# EAGLE design Sensorboard (EAGLE 9.6.2)
Assembly variants: Ohne Dioden
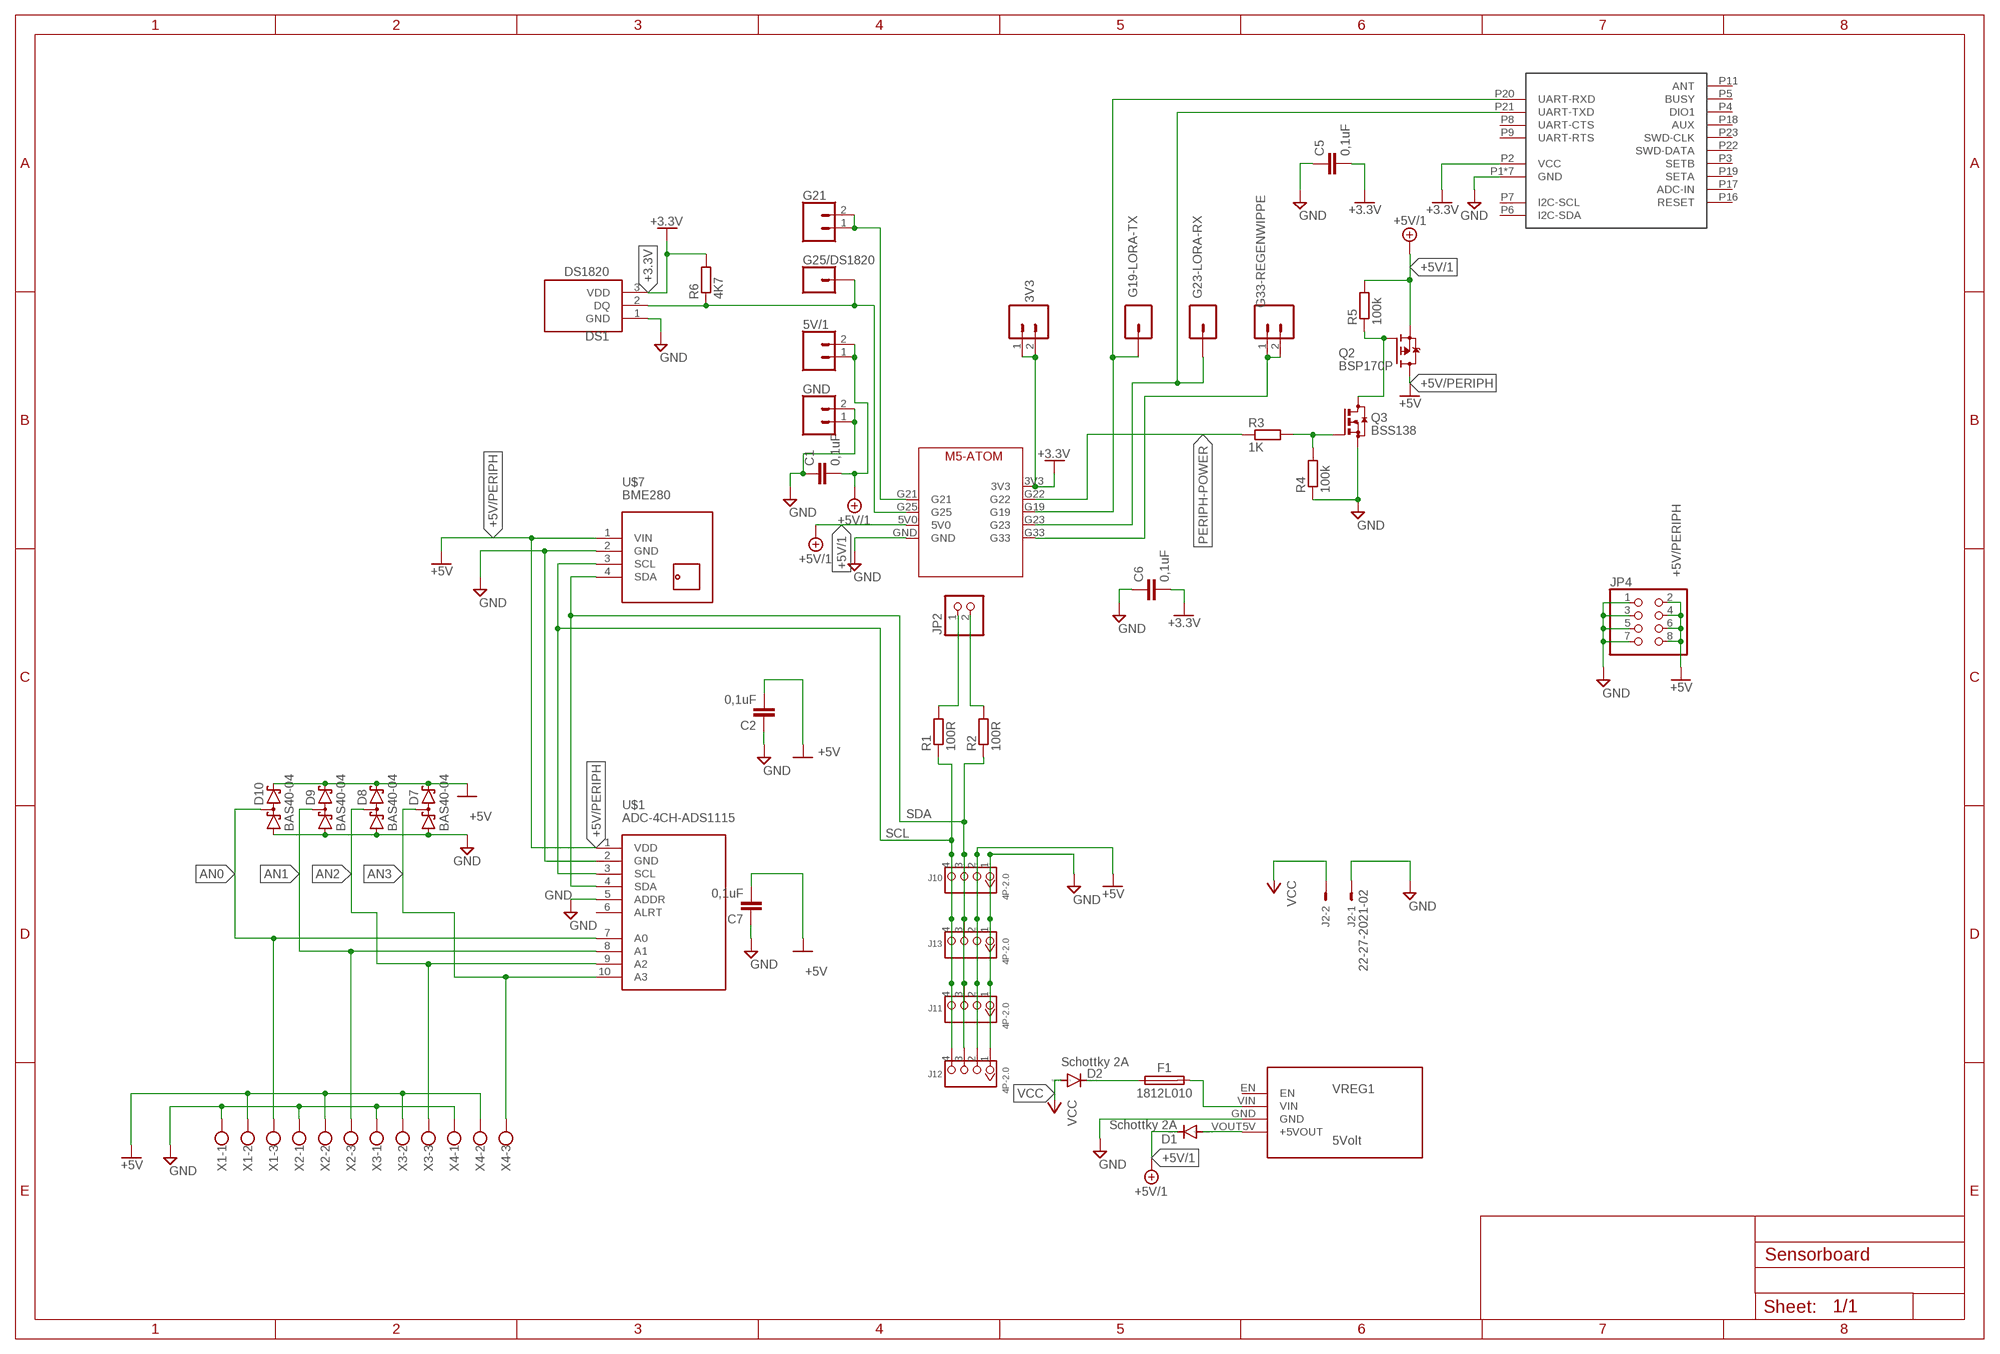
[diagram p0: schematic, sheet 1]

## Parts
3V3  CONN_02  [1X02]
5V/1  CONN_02  [1X02]
C1  0,1uF  C-EU025-025X050  [C025-025X050]
C2  0,1uF  C-EU025-025X050  [C025-025X050]
C5  0,1uF  C-EU025-025X050  [C025-025X050]
C6  0,1uF  C-EU025-025X050  [C025-025X050]
C7  0,1uF  C-EU025-025X050  [C025-025X050]
D1  Schottky 2A  1N4004  [DO41-10]
D2  Schottky 2A  1N4004  [DO41-10]
D7  BAS40-04  [SOT23]  (not fitted in variant Ohne Dioden)
D8  BAS40-04  [SOT23]  (not fitted in variant Ohne Dioden)
D9  BAS40-04  [SOT23]  (not fitted in variant Ohne Dioden)
D10  BAS40-04  [SOT23]  (not fitted in variant Ohne Dioden)
DS1  DS1820  [DS1820-TO92]
F1  1812L010  [FUSC4532X125]
G19-LORA-TX  CONN_01  [1X01]
G21  CONN_02  [1X02]
G23-LORA-RX  CONN_01  [1X01]
G25/DS1820  CONN_01  [1X01]
G33-REGENWIPPE  CONN_02  [1X02]
GND  CONN_02  [1X02]
J2  22-27-2021-02  [6410-02]
J10  4P-2.0  GROVE-CONNECTOR-DIP(4P-2.0)  [HW4-2.0]
J11  4P-2.0  GROVE-CONNECTOR-DIP(4P-2.0)  [HW4-2.0]
J12  4P-2.0  GROVE-CONNECTOR-DIP(4P-2.0)  [HW4-2.0]
J13  4P-2.0  GROVE-CONNECTOR-DIP(4P-2.0)  [HW4-2.0]
JP2  PINHD-1X2  [1X02]
JP4  PINHD-2X4  [2X04]
M5-ATOM  M5-ATOM  [M5-ATOM]
Q2  BSP170P  [SOT223]
Q3  BSS138  BSS123  [SOT23]
R1  100R  R-EU_0204/7  [0204/7]
R2  100R  R-EU_0204/7  [0204/7]
R3  1K  R-EU_R1206  [R1206]
R4  100k  R-EU_R1206  [R1206]
R5  100k  R-EU_R1206  [R1206]
R6  4K7  R-EU_R1206  [R1206]
U$1  ADC-4CH-ADS1115  [ADC-4CH-ADS1115]
U$2  E78-868LN22S  [E78-868LN22S]
U$7  BME280  TEMP-HUM-PRES-BME280  [TEMP-HUM-PRES-BME280]
VREG1  5Volt  VREG-STEPDOWN  [VREG-STEPDOWN]
X1  W237-103-RB  [W237-103-RB]
X2  W237-103-RB  [W237-103-RB]
X3  W237-103-RB  [W237-103-RB]
X4  W237-103-RB  [W237-103-RB]

## Nets
+3.3V [3V]: 3V3.1 3V3.2 C5.2 C6.2 DS1.3(VDD) M5-ATOM.3V3 R6.2 U$2.P2(VCC)
+5V/1: 5V/1.1 5V/1.2 C1.2 D1.C M5-ATOM.5V0 Q2.3(S) R5.2
+5V/PERIPH [5V]: C2.2 C7.2 D7.2(C2) D8.2(C2) D9.2(C2) D10.2(C2) J10.2 J11.2 J12.2 J13.2 JP4.2 JP4.4 JP4.6 JP4.8 Q2.2(D) Q2.4(D) U$1.1(VDD) U$7.1(VIN) X1.2 X2.2 X3.2 X4.2 ; supply symbol labelled +5V
AN0 [Analog]: D10.3(C1A2) U$1.7(A0) X1.3
AN1 [Analog]: D9.3(C1A2) U$1.8(A1) X2.3
AN2 [Analog]: D8.3(C1A2) U$1.9(A2) X3.3
AN3 [Analog]: D7.3(C1A2) U$1.10(A3) X4.3
GND: C1.1 C2.1 C5.1 C6.1 C7.1 D7.1(A1) D8.1(A1) D9.1(A1) D10.1(A1) DS1.1(GND) GND.1 GND.2 J2.1 J10.1 J11.1 J12.1 J13.1 JP4.1 JP4.3 JP4.5 JP4.7 M5-ATOM.GND Q3.2(S) R4.1 U$1.2(GND) U$1.5(ADDR) U$2.P1(GND) U$2.P10(GND) U$2.P12(GND) U$2.P13(GND) U$2.P14(GND) U$2.P15(GND) U$2.P24(GND) U$7.2(GND) VREG1.GND X1.1 X2.1 X3.1 X4.1
LORA-RX [Signal]: G23-LORA-RX.1 M5-ATOM.G23 U$2.P21(UART-TXD)
LORA-TX [Signal]: G19-LORA-TX.1 M5-ATOM.G19 U$2.P20(UART-RXD)
N$4 [Signal]: G33-REGENWIPPE.1 G33-REGENWIPPE.2 M5-ATOM.G33
N$5: JP2.1 R1.2
N$6 [Signal]: DS1.2(DQ) G25/DS1820.1 M5-ATOM.G25 R6.1
N$7 [Signal]: G21.1 G21.2 M5-ATOM.G21
N$8: JP2.2 R2.2
N$9: D1.A VREG1.VOUT5V(+5VOUT)
N$11: Q3.1(G) R3.2 R4.2
N$12: D2.C F1.1
N$13: F1.2 VREG1.VIN
N$16: Q2.1(G) Q3.3(D) R5.1
PERIPH-POWER [Signal]: M5-ATOM.G22 R3.1
SCL [Signal]: J10.4 J11.4 J12.4 J13.4 R1.1 U$1.3(SCL) U$7.3(SCL)
SDA [Signal]: J10.3 J11.3 J12.3 J13.3 R2.1 U$1.4(SDA) U$7.4(SDA)
VCC: D2.A J2.2
Unconnected: U$1.6(ALRT) U$2.P3(SETB) U$2.P4(DIO1) U$2.P5(BUSY) U$2.P6(I2C-SDA) U$2.P7(I2C-SCL) U$2.P8(UART-CTS) U$2.P9(UART-RTS) U$2.P11(ANT) U$2.P16(RESET) U$2.P17(ADC-IN) U$2.P18(AUX) U$2.P19(SETA) U$2.P22(SWD-DATA) U$2.P23(SWD-CLK) VREG1.EN

## Library data of the parts
3V3 5V/1 G21 G33-REGENWIPPE GND = SparkFun-Connectors:CONN_02: Multi connection point. Often used as Generic Header-pin footprint for 0.1 inch spaced/style header connections On any of the 0.1 inch spaced packages, you can populate with these: Break Away Headers - Straight <https://www.sparkfun.com/products/116> (PRT-00116) Break Away Male Headers - Right Angle <https://www.sparkfun.com/products/553> (PRT-00553) Female Headers <https://www.sparkfun.com/products/115> (PRT-00115) Break Away Headers - Machine Pin <https://www.sparkfun.com/products/117> (PRT-00117) Break Away Female Headers - Swiss Machine Pin <https://www.sparkfun.com/products/743> (PRT-00743) For SCREWTERMINALS and SPRING TERMINALS visit here: Screw Terimnals on SparkFun.com <https://www.sparkfun.com/search/results?term=Screw+Terminals> (5mm/3.5mm/2.54mm spacing) This device is also useful as a general connection point to wire up your design to another part of your project. Our various solder wires solder well into these plated through hole pads. Hook-Up Wire - Assortment (Stranded, 22 AWG) <https://www.sparkfun.com/products/11375> (PRT-11375) Hook-Up Wire - Assortment (Solid Core, 22 AWG) <https://www.sparkfun.com/products/11367> (PRT-11367) View the entire wire category on our website here <https://www.sparkfun.com/categories/141> Special notes: Molex polarized connector foot print use with: PRT-08233 with associated crimp pins and housings. 2.54_SCREWTERM for use with PRT-10571. 3.5mm Screw Terminal footprints for PRT-08084 5mm Screw Terminal footprints for use with PRT-08432
C1 C2 C5-C7 = rcl:C-EU: CAPACITOR, European symbol; SPICEPREFIX: C
D1 D2 = diode:1N4004: DIODE general purpose rectifier, 1 A
D7-D10 = diode:BAS40-04: Silicon Schottky Diodes General-purpose diode for high-speed switching
DS1 = RB-diy-modules:DS1820: DS1820 Temperatursensor
F1 = Fuse:1812L: 1812L Series PTC provides surface mount overcurrent protection for applications where resettable protection is desired. Datasheet <https://www.littelfuse.com/~/media/electronics/datasheets/resettable_ptcs/littelfuse_ptc_1812l_datasheet.pdf.pdf>; CATEGORY: FUSE; DESCRIPTION: Resettable PTCs; MANUFACTURER: Littlefuse; MPN: 1812L010; OPERATING_TEMPERATURE: -40°C to +85°C; PART_STATUS: ACTIVE; ROHS_COMPLIANCE: RoHS Compliant; SERIES: 1812L; SUBCATEGORY: Resettable; TYPE: PTC
G19-LORA-TX G23-LORA-RX G25/DS1820 = SparkFun-Connectors:CONN_01: Single connection point. Often used as Generic Header-pin footprint for 0.1 inch spaced/style header connections On any of the 0.1 inch spaced packages, you can populate with these: Break Away Headers - Straight <https://www.sparkfun.com/products/116> (PRT-00116) Break Away Male Headers - Right Angle <https://www.sparkfun.com/products/553> (PRT-00553) Female Headers <https://www.sparkfun.com/products/115> (PRT-00115) Break Away Headers - Machine Pin <https://www.sparkfun.com/products/117> (PRT-00117) Break Away Female Headers - Swiss Machine Pin <https://www.sparkfun.com/products/743> (PRT-00743) This device is also useful as a general connection point to wire up your design to another part of your project. Our various solder wires solder well into these plated through hole pads. Hook-Up Wire - Assortment (Stranded, 22 AWG) <https://www.sparkfun.com/products/11375> (PRT-11375) Hook-Up Wire - Assortment (Solid Core, 22 AWG) <https://www.sparkfun.com/products/11367> (PRT-11367) View the entire wire category on our website here <https://www.sparkfun.com/categories/141> Special notes: SMTSO-256-ET is a "flush mount" nut for a 4-40 screw. We mostly use this on specialty testbeds; it is a nice way to connect hardware to your PCB at an adjustable hieght. Also note, the SNAP packages are for using a snappable style connector. We sell a baggie of snaps and they are also used on two LilyPad designs: Snap Assortment - 30 pack (male and female) <https://www.sparkfun.com/products/11347> (DEV-11347) LilyPad Arduino SimpleSnap <https://www.sparkfun.com/products/10941> (DEV-10941) LilyPad SimpleSnap Protoboard <https://www.sparkfun.com/products/10940> (DEV-10940)
J2 = con-molex:22-?-02: CONNECTOR wire to board 2.54 mm (.1 inch) pitch header; MF: MOLEX; OC_FARNELL: unknown; OC_NEWARK: unknown
J10-J13 = OPL_Connector:GROVE-CONNECTOR-DIP(4P-2.0): 320110033
JP2 = pinhead:PINHD-1X2: PIN HEADER
JP4 = pinhead:PINHD-2X4: PIN HEADER
M5-ATOM = RB-M5-ATOM-LIB:M5-ATOM
Q2 = transistor-fet:BSP170P: SIPMOS(R) Small-Signal-Transistor P-Channel, Enhancement mode Source: http://www.infineon.com/upload/Document/BSP170P_Rev2.4.pdf
Q3 = transistor-small-signal:BSS123: N-CHANNEL MOS FET
R1-R6 = rcl:R-EU_: RESISTOR, European symbol; SPICEPREFIX: R
U$1 = RB-diy-modules:ADC-4CH-ADS1115: 4 Channel 16-Bit Analog-to-Digital Converter based on ADS1115 chip Auf schmale Version ohne Bohrungen umgestellt. April2021 rb Arduino ADS1115 Getting Started Tutorial is available here: http://henrysbench.capnfatz.com/henrys-bench/arduino-voltage-measurements/arduino-ads1115-module-getting-started-tutorial/ ADS1115 datasheet is available here: http://www.ti.com/lit/ds/symlink/ads1115.pdf Click here to find device on ebay.com <http://www.ebay.com/sch/ads1115+module>
U$2 = E78-868LN22S:E78-868LN22S: Check prices <https://pricing.snapeda.com/parts/E22-900M22S/EBYTE/view-part?ref=eda>
U$7 = RB-diy-modules:TEMP-HUM-PRES-BME280: Digital Humidity-Temperature-Pressure Sensor based on BME280 device More information about BME280 device is available here: https://www.bosch-sensortec.com/bst/products/all_products/bme280 Click here to find device on ebay.com <http://www.ebay.com/sch/bme280+breakout>
VREG1 = RB-diy-modules:VREG-STEPDOWN
X1-X4 = RB_con-wago-500:W237-103-RB: WAGO SCREW CLAMP

## Net classes
1 5V: width 0.508 mm
2 3V: width 0.508 mm
3 Signal: width 0.152 mm
4 Analog: width 0.203 mm

## Board
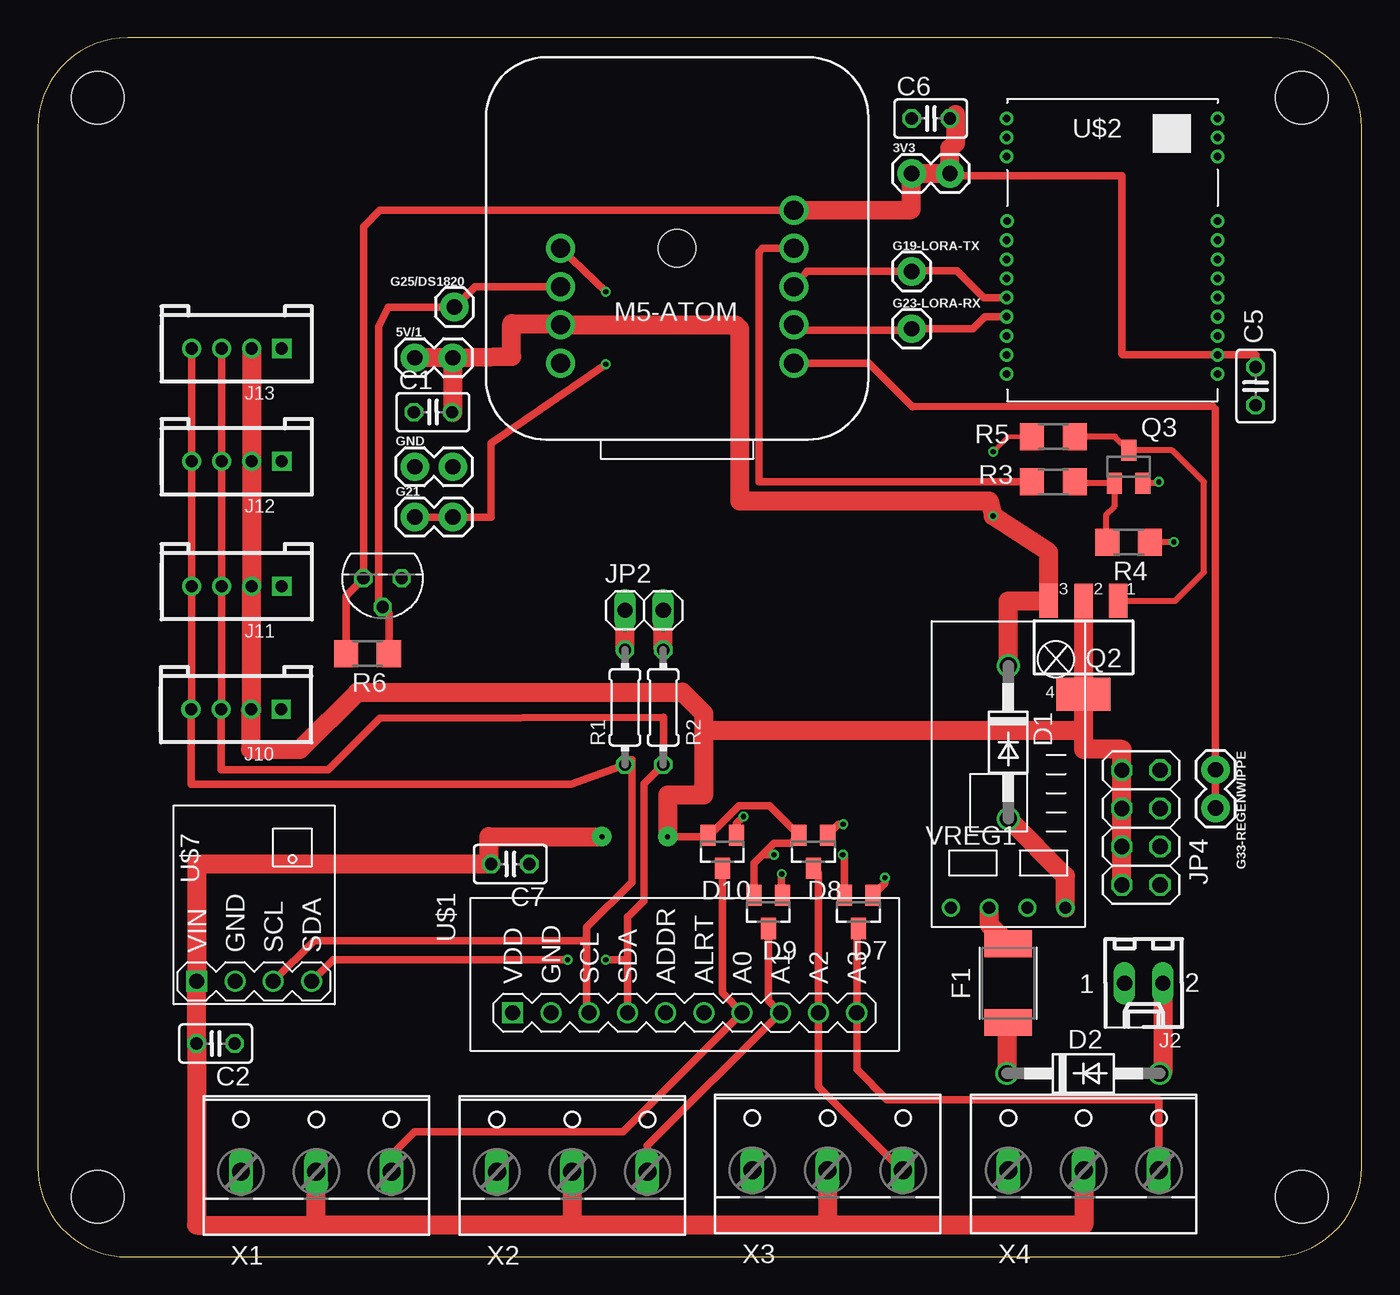
[diagram p1: board, top side]
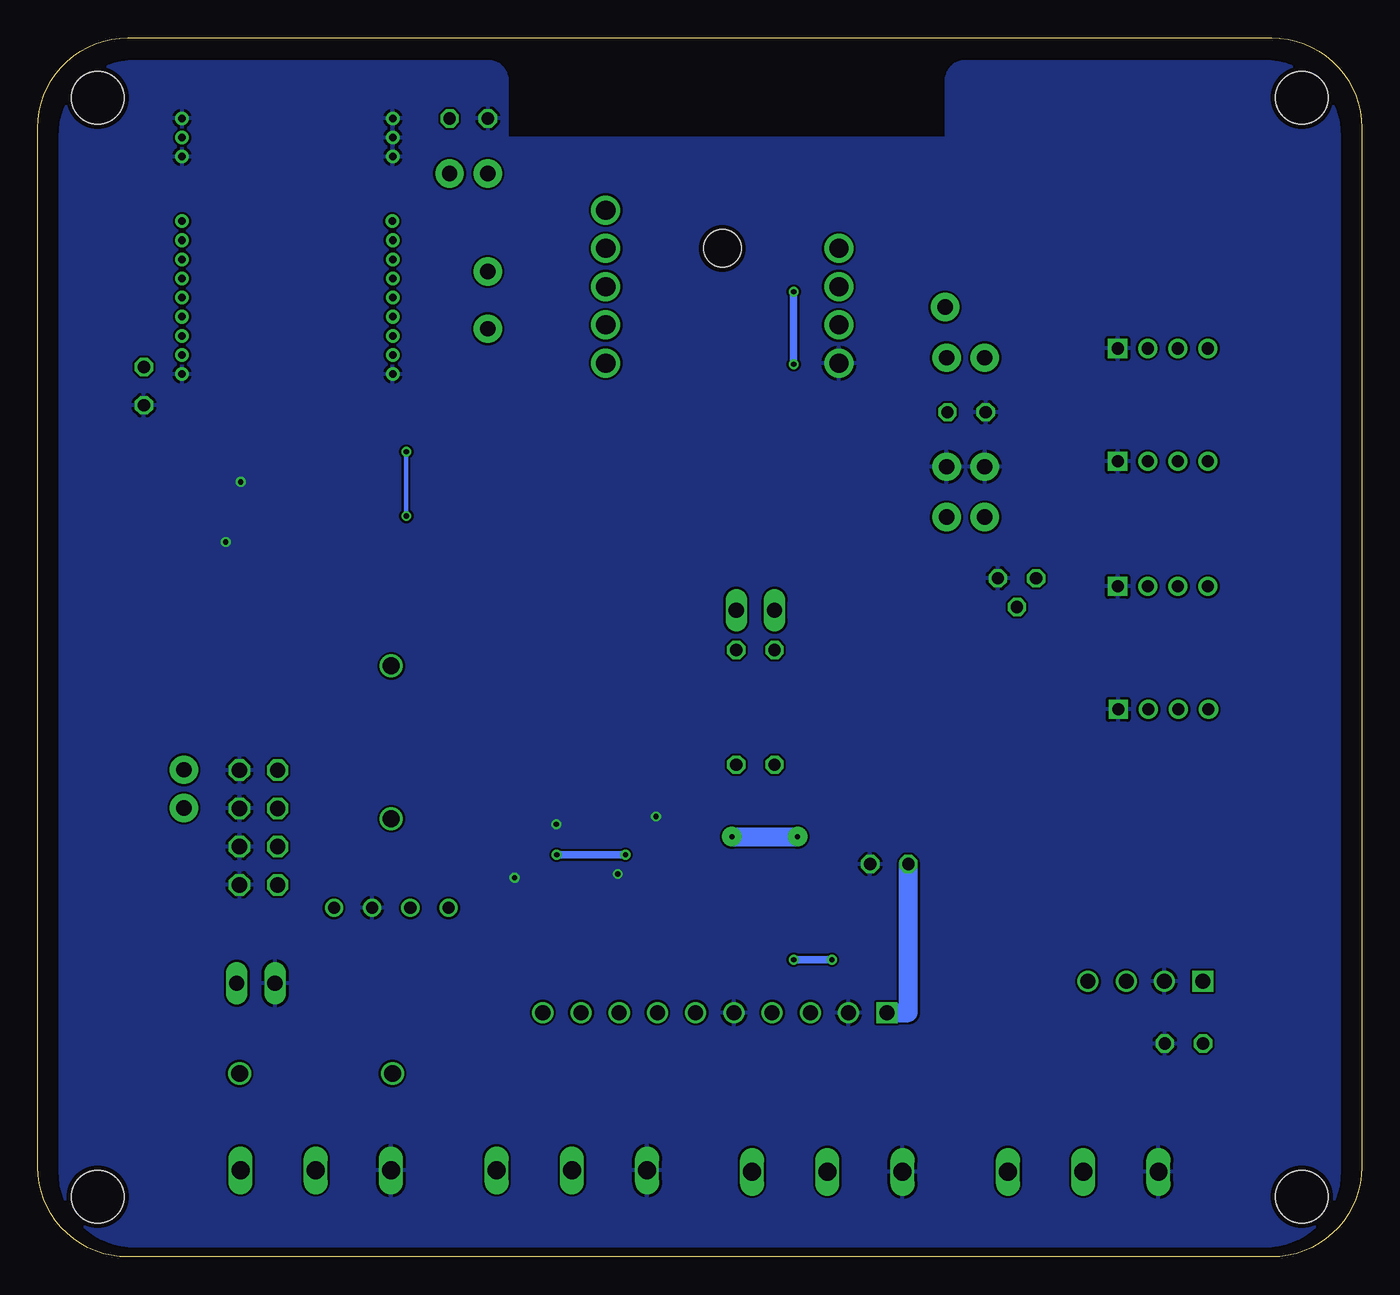
[diagram p2: board, bottom side, seen from below]

Size 88 x 81 mm. Coordinates in mm from the lower left corner, seen from the top.
Outline: 88,6 88,75 arc90 82,81 6,81 arc90 0,75 0,6 arc90 6,0 82,0 arc90 88,6
Copper layers (1*16): Top 0.035mm / dielectric 1.5mm / Bottom 0.035mm
Design rules "PCB-POOL Standard": minimum track width 0.15mm, minimum drill 0.3mm, track to track 0.15mm, track to pad 0.15mm, pad to pad 0.15mm, via to via 0.15mm, smd to smd 0.15mm, copper to edge 0.3mm, drill to drill 0.2mm, minimum pad ring 0.2mm, minimum via ring 0.15mm, stop-mask expansion 0.03mm, vias tented up to drill 0mil, thermal gap 0.2mm
Holes 3.5 mm at 4,4 84,4 84,77 4,77

### Footprints (pad centres in the part's own frame; a part is rotated, then mirrored left to right if it is on the bottom)
1X02 = drill 1.016 pad 1.88: 1 0,0; 2 2.54,0
C025-025X050 = drill 0.813 octagon: 1 -1.27,0; 2 1.27,0
DO41-10 = drill 1.118: A 5.08,0; C -5.08,0
SOT23 = smd 1 x 1.4: 1 -0.95,-1.1; 2 0.95,-1.1; 3 0,1.1
DS1820-TO92 = drill 0.813 octagon: 1 -1.27,0; 2 0,1.905; 3 1.27,0
FUSC4532X125 = smd 1.78 x 3.15: 1 -2.615,0; 2 2.615,0
1X01 = drill 1.016 pad 1.88: 1 0,0
6410-02 = drill 1.016 long: 1 1.27,0; 2 -1.27,0
HW4-2.0 = drill 0.8 pad 1.27 square: 1 -3,0 | drill 0.8 pad 1.27: 2 -1,0; 3 1,0; 4 3,0
1X02' = drill 1.016 long: 1 -1.27,0; 2 1.27,0
2X04 = drill 1.016 octagon: 1 -3.81,-1.27; 2 -3.81,1.27; 3 -1.27,-1.27; 4 -1.27,1.27; 5 1.27,-1.27; 6 1.27,1.27; 7 3.81,-1.27; 8 3.81,1.27
M5-ATOM = drill 1.27 pad 1.93: 3V3 7.747,2.54; 5V0 -7.747,-5.08; G19 7.747,-2.54; G21 -7.747,0; G22 7.747,0; G23 7.747,-5.08; G25 -7.747,-2.54; G33 7.747,-7.62; GND -7.747,-7.62 | hole 2.5: 0,0
SOT223 = smd 1.219 x 2.235: 1 -2.311,-3.099; 2 0,-3.099; 3 2.311,-3.099 | smd 3.6 x 2.2: 4 0,3.099
0204/7 = drill 0.813 octagon: 1 -3.81,0; 2 3.81,0
R1206 = smd 1.6 x 1.803: 1 -1.422,0; 2 1.422,0
ADC-4CH-ADS1115 = drill 1 square: 1 -6.35,11.43 | drill 1: 2 -6.35,8.89; 3 -6.35,6.35; 4 -6.35,3.81; 5 -6.35,1.27; 6 -6.35,-1.27; 7 -6.35,-3.81; 8 -6.35,-6.35; 9 -6.35,-8.89; 10 -6.35,-11.43
E78-868LN22S = drill 0.5: P1 0,18.25; P2 0,16.98; P3 0,15.71; P4 0,14.44; P5 0,13.17; P6 0,11.9; P7 0,10.63; P8 0,9.36; P9 0,8.09; P10 0,3.81; P11 0,2.54; P12 0,1.27; P13 14,1.27; P14 14,2.54; P15 14,3.81; P16 13.97,8.09; P17 14,9.36; P18 14,10.63; P19 14,11.9; P20 14,13.17; P21 14,14.44; P22 14,15.71; P23 14,16.98; P24 14,18.25
TEMP-HUM-PRES-BME280 = drill 1 square: 1 -5.08,3.81 | drill 1: 2 -5.08,1.27; 3 -5.08,-1.27; 4 -5.08,-3.81
VREG-STEPDOWN = drill 0.8: EN 0,3.81; GND 0,-1.27; VIN 0,1.27; VOUT5V 0,-3.81
W237-103-RB = drill 1.194 long: 1 -5,-1.29; 2 0,-1.29; 3 5,-1.29

### Placement (x,y rotation side)
3V3  58.08,71.98 0 top
5V/1  25.06,59.74 0 top
C1  26.27,56.12 0 top
C2  11.83,14.18 180 top
C5  80.94,57.85 90 top
C6  59.35,75.63 0 top
C7  31.41,26.1 180 top
D1  64.5,34.19 270 top
D2  69.5,12.19 0 top
D7  54.55,22.92 180 top  (not fitted)
D8  51.55,26.92 180 top  (not fitted)
D9  48.55,22.92 180 top  (not fitted)
D10  45.5,26.92 180 top  (not fitted)
DS1  22.92,45.08 180 top
F1  64.5,18.19 90 top
G19-LORA-TX  58.08,65.47 0 top
G21  25.06,49.15 0 top
G23-LORA-RX  58.08,61.66 0 top
G25/DS1820  27.7,63.1 0 top
G33-REGENWIPPE  78.28,32.36 270 top
GND  25.06,52.5 0 top
J2  73.5,18.19 180 top
J10  13.19,36.38 180 top
J11  13.23,44.55 180 top
J12  13.23,52.85 180 top
J13  13.23,60.35 180 top
JP2  [1X02']  40.3,42.96 0 top
JP4  73.32,28.53 90 top
M5-ATOM  42.5,67 0 top
Q2  69.5,40.49 180 top
Q3  72.5,52.49 0 top
R1  39.03,36.51 90 top
R2  41.57,36.51 90 top
R3  67.5,51.49 0 top
R4  72.5,47.49 180 top
R5  67.5,54.49 180 top
R6  21.92,40.08 180 top
U$1  43,22.58 90 top
U$2  78.4,76.9 180 top
U$7  14.39,23.39 90 top
VREG1  64.5,23.19 90 top
X1  18.51,6.95 0 top
X2  35.52,6.95 0 top
X3  52.5,7.05 0 top
X4  69.51,7.05 0 top

### Tracks (layer width: path | path; a pad name or v marks a point on that pad's centre or on a via)
+3.3V
  Top 0.508: R6.2 20.5,43.93 DS1.3 21.65,68.45 22.74,69.54 M5-ATOM.3V3 | 3V3.2 60.78,71.82 72.05,71.82 72.05,60 72.13,59.92 U$2.P2 80.94,59.92 C5.2 | C6.2 61,75.63 61,75.9
  Top 1.27: M5-ATOM.3V3 58.06,69.58 3V3.1 3V3.2 60.62,73.62 61,74 61,75.9
+5V/1  (via drill 0.35)
  Top 0.152: C1.2 27.58,56.12 27.6,56.1
  Top 0.305: v63.5,53.49 64.5,54.49 R5.2
  Top 1.27: 5V/1.2 5V/1.1 | 5V/1.2 31.5,59.83 31.5,62 34.8,62 M5-ATOM.5V0 46.39,61.92 46.65,61.66 46.65,50.23 63.24,50.23 v63.5,49.22 67.19,46.8 Q2.3 64.5,43.59 D1.C | 27.6,56.1 5V/1.2
  Bottom 0.305: v63.5,49.22 v63.5,53.49
+5V/PERIPH  (via drill 0.35, 0.35 pad 1.3)
  Top 0.508: 48.17,26.72 48.94,27.48 50.06,27.48 D8.2 48.63,29.99 46.6,29.99 44.63,28.02 D10.2 44.45,27.92 44.45,27.91 v41.86,27.92 | 48.17,26.72 47.6,26.15 D9.2 | D7.2 53.6,26.62 v53.51,26.72 | v48.94,26.72 48.17,26.72 | 72.05,24.83 JP4.8 | 10.56,2.11 10.6,2.11
  Top 1.27: J13.2 J12.2 J11.2 14.23,36.38 J10.2 14.15,36.34 14.15,33.72 17.44,33.72 21.25,37.53 42.84,37.53 44.26,36.11 44.26,34.99 | 10.6,2.11 18.5,2.11 18.51,2.12 | v37.5,27.92 30,27.92 30,26.1 C7.2 10.58,26.1 U$7.1 10.58,14.32 10.56,14.32 C2.2 10.56,2.11 | Q2.2 Q2.4 69.5,34.99 | 69.5,34.99 69.5,33.72 72.05,33.72 JP4.8 JP4.6 JP4.4 72.05,24.83 JP4.2 | 44.26,34.99 69.5,34.99 | 44.26,34.99 44.26,30.68 41.86,30.68 v41.86,27.92 | 18.51,2.12 X1.2 | X2.2 35.52,2.12 | 35.52,2.12 18.51,2.12 | X3.2 52.5,2.12 | 52.5,2.12 35.52,2.12 | X4.2 69.51,2.12 52.5,2.12
  Bottom 0.508: v53.51,26.72 v48.94,26.72
  Bottom 1.27: v41.86,27.92 v37.5,27.92 | U$1.1 30.14,16.23 C7.2
AN0
  Top 0.508: D10.3 45.5,17.54 U$1.7 38.9,8.32 25.06,8.32 23.5,6.76 23.51,6.76 X1.3
AN1
  Top 0.508: D9.3 48.55,17.03 U$1.8 40.5,7.38 40.52,7.38 X2.3
AN2
  Top 0.508: D8.3 51.89,25.48 U$1.9 51.89,11.32 57.45,5.76 X3.3
AN3
  Top 0.508: D7.3 54.43,21.7 U$1.10 54.43,12.46 56.43,10.46 74.5,10.46 74.51,10.45 X4.3
GND  (via drill 0.35)
  Top 0.406: v74.5,51.49 74.4,51.39 Q3.2 | v75.5,47.49 R4.1
  Top 0.508: D10.1 46.45,28.8 v46.9,29.26 | D9.1 49.44,24.08 v49.44,25.45 | D8.1 53.23,28.75 v53.53,28.75 | D7.1 56.3,24.82 v56.3,25.19
  pour Bottom: 26.33,79.44 6.5,79.44 arc90 1.5,74.44 1.5,5.7 arc90 6.5,0.7 81.5,0.7 arc90 86.5,5.7 86.5,74.36 86.5,74.44 arc90 81.5,79.44 58.08,79.44 arc90 56.81,78.17 56.81,74.36 27.6,74.36 27.6,78.17 arc90
LORA-RX
  Top 0.508: M5-ATOM.G23 50.47,61.57 57.99,61.57 G23-LORA-RX.1 62.16,61.66 62.96,62.46 U$2.P21
LORA-TX
  Top 0.508: U$2.P20 62.87,63.73 61.1,65.5 58.11,65.5 G19-LORA-TX.1 51.13,65.47 M5-ATOM.G19
N$4
  Top 0.508: M5-ATOM.G33 55.26,59.38 58.15,56.49 78.1,56.5 78.28,56.32 G33-REGENWIPPE.1 G33-REGENWIPPE.2
N$5
  Top 1.27: R1.2 JP2.1
N$6
  Top 0.508: R6.1 23.34,42.75 DS1.2 22.66,43.44 22.66,61.79 23.3,63.1 G25/DS1820.1 29.06,64.46 M5-ATOM.G25
N$7  (via drill 0.35)
  Top 0.508: G21.1 G21.2 30.14,49.15 30.14,54.04 v37.76,59.31 | M5-ATOM.G21 v37.76,64.12
  Bottom 0.508: v37.76,64.12 v37.76,59.31
N$8
  Top 1.27: R2.2 JP2.2
N$9
  Top 1.27: VREG1.VOUT5V 68.31,25.3 D1.A
N$11
  Top 0.406: R3.2 69.02,51.39 Q3.1 71.55,49.84 71,49.29 71,47.57 R4.2
N$12
  Top 1.27: F1.1 64.42,15.5 D2.C
N$13
  Top 1.27: F1.2 63.23,22.08 VREG1.VIN
N$16
  Top 0.406: R5.1 71.6,54.49 Q3.3 75.4,53.59 77.5,51.49 77.5,45.49 75.6,43.59 Q2.1
PERIPH-POWER
  Top 0.254: 47.93,51.49 47.92,51.5
  Top 0.508: R3.1 47.93,51.49 | 47.92,51.5 47.92,66.74 48.18,67 M5-ATOM.G22
SCL
  Top 0.508: J13.4 J12.4 J11.4 10.23,36.38 J10.4 10.19,31.42 35.45,31.42 R1.1 39.36,33.03 39.5,33.03 39.5,24.9 36.49,21.89 36.49,21.02 | U$1.3 36.49,16.23 36.49,21.02 | U$7.3 18.37,21.02 36.49,21.02
SDA  (via drill 0.35)
  Top 0.508: J13.3 J12.3 J11.3 12.23,36.38 J10.3 12.19,32.37 19.3,32.37 22.72,35.78 41.6,35.84 41.6,32.73 R2.1 40.3,31.43 40.3,23.67 39.22,22.59 39.19,22.59 39.19,19.75 | U$1.4 39.19,19.75 | U$7.4 19.64,19.75 v35.22,19.75 | v37.76,19.75 39.19,19.75
  Bottom 0.508: v35.22,19.75 v37.76,19.75
VCC
  Top 1.27: J2.2 74.77,12.19 D2.A

### Text on the board
Document: Achtung! / Bestückungsaufdruck / der Grove-Stecker / um 180° gedreht